# Altium schematic sheet BatteryControl.SchDoc
size A
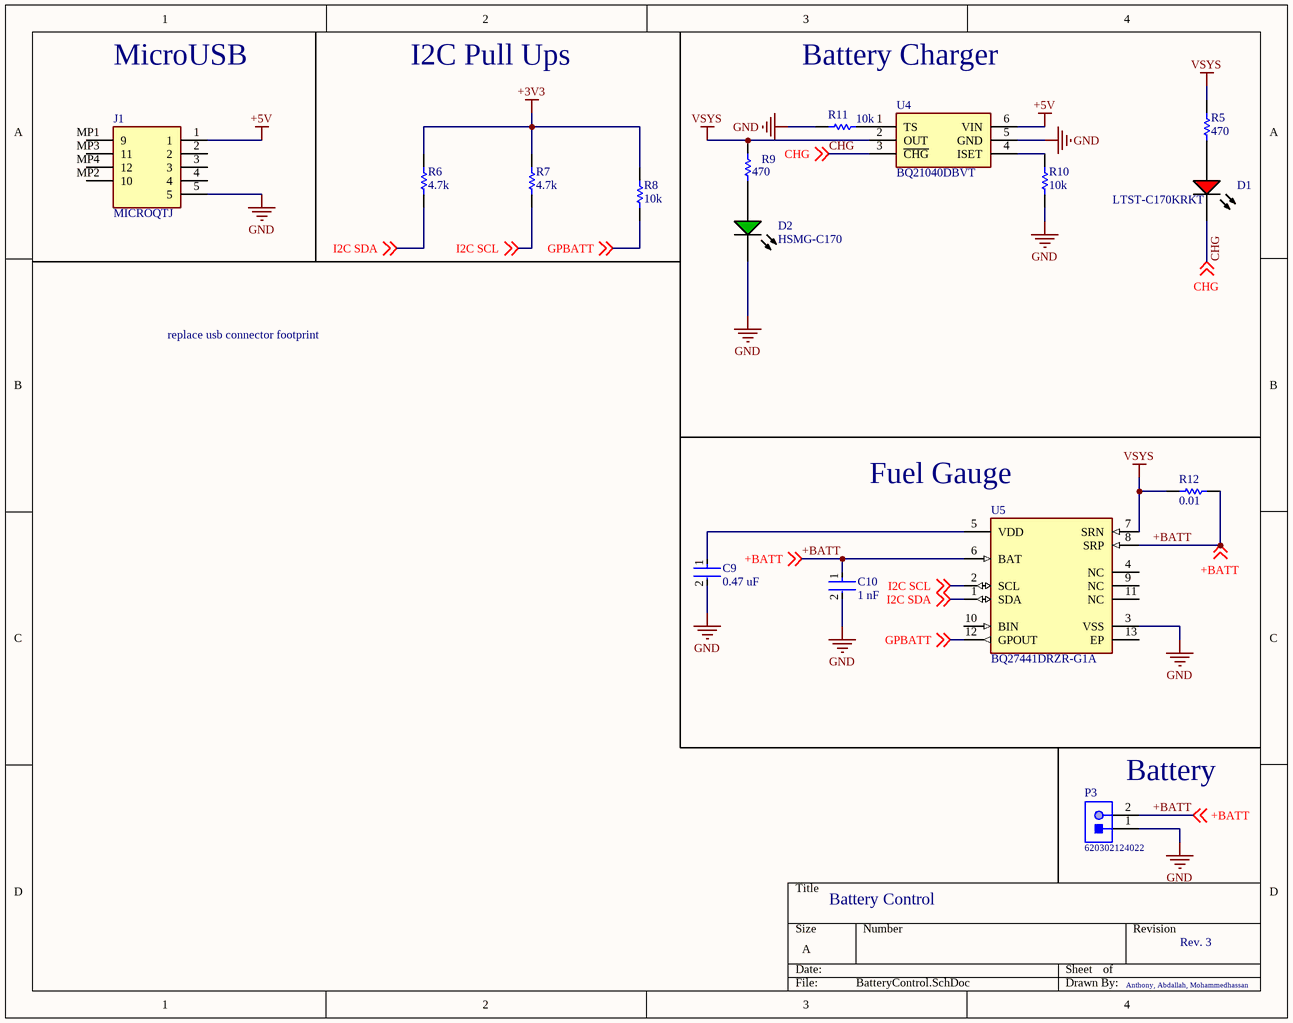
[diagram p0: BatteryControl.SchDoc]

## Parts
C9  0.47 uF  [FP-C0805C-DG-MFG]
C10  1 nF  [FP-C0805C-DG-MFG]
D1  LTST-C170KRKT  [LTST-C170KRKT_V]
D2  HSMG-C170  [AVAG-HSMX-C170_V]
J1  MICROQTJ  [MICROQTJ]
P3  620302124022  [620302124022]
R5  value 470  [RESC2013X70X40ML20T20]  (hidden comment: Resistor 1k +/-1% 0805 125 mW)
R6  value 4.7k  [RESC2013X70X40ML20T20]  (hidden comment: Resistor 1k +/-1% 0805 125 mW)
R7  value 4.7k  [RESC2013X70X40ML20T20]  (hidden comment: Resistor 1k +/-1% 0805 125 mW)
R8  value 10k  [RESC2013X70X40ML20T20]  (hidden comment: Resistor 1k +/-1% 0805 125 mW)
R9  value 470  [RESC2013X70X40ML20T20]  (hidden comment: Resistor 1k +/-1% 0805 125 mW)
R10  value 10k  [RESC2013X70X40ML20T20]  (hidden comment: Resistor 1k +/-1% 0805 125 mW)
R11  value 10k  [RESC2013X70X40ML20T20]  (hidden comment: Resistor 1k +/-1% 0805 125 mW)
R12  value 0.01  [RESC2013X70X40ML20T20]  (hidden comment: Resistor 1k +/-1% 0805 125 mW)
U4  BQ21040DBVT  [SOT95P280X145-6N]
U5  BQ27441DRZR-G1A  [FP-DRZ0012A-MFG]

## Nets
+3V3: R6.2 R7.2 R8.2
+5V: J1.1 U4.6(VIN)
GND: C9.2 C10.2 D2.2(K) J1.5 P3.1 R10.2 R11.2 U4.5(GND) U5.3(VSS)
VSYS: R5.2 R9.2 R12.2 U4.2(OUT) U5.7(SRN)
+BATT: C10.1 P3.2 R12.1 U5.6(BAT) U5.8(SRP) ; off-sheet +BATT
CHG: D1.2(K) U4.3(~{CHG}) ; off-sheet CHG
GPBATT: R8.1 U5.12(GPOUT) ; off-sheet GPBATT
I2C SCL: R7.1 U5.2(SCL) ; off-sheet I2C SCL
I2C SDA: R6.1 U5.1(SDA) ; off-sheet I2C SDA
NetC9_1: C9.1 U5.5(VDD)
NetD1_1: D1.1(A) R5.1
NetD2_1: D2.1(A) R9.1
NetR10_1: R10.1 U4.4(ISET)
NetR11_1: R11.1 U4.1(TS)

Not connected (* = marked no-connect by the designer): J1 2 3 4 MP1(9) MP2(10) MP3(11) MP4(12); U5 4(NC) 9(NC) 10(BIN) 11(NC) 13(EP)

## Notes on the sheet
- MicroUSB
- I2C Pull Ups
- Battery Charger
- replace usb connector footprint
- (near U5) Fuel Gauge
- (near P3) Battery
- Battery Control
- Rev. 3
- Anthony, Abdallah, Mohammedhassan

## Library data of the parts
C9 C10 = CMP-2007-03243-2: CAP CER 10UF 10V X5R 0805; Manufacturer Part Number: C0805C106K8PACTU; Manufacturer: Kemet; 3DS Part Number: 220-00001; Tolerance: 10%; Temperature Coefficient: 15%; Material: Ceramic; Device Class L2: Capacitors; Device Class L1: Passive Components; ComponentLink2URL: https://content.kemet.com/datasheets/KEM_C1006_X5R_SMD.pdf; Height: 1.4mm; Lead Free: Yes; Digikey Description: CAP CER 10UF 10V X5R 0805; Octopart: https://octopart.com/c0805c106k8pactu-kemet-98697; Capacitance: 10uF; Value: 10uF; Temperature Range Low: -55°C; Temperature: -55°C to +85°C; Automotive: No; Mouser Description: CAP CER 10UF 10V X5R 0805; Ipc Land Pattern Name: CAPC200125X125; Temperature Range High: +85°C; Voltage: 10V; RoHS: TRUE; Device Class L3: Ceramic Capacitors; ComponentLink2Description: Datasheet; Voltage Rating: 10V; Package: C0805C-DG; Temperature Characteristic: X5R; Category: Cap
D1 = CMP-2000-07593-1: LED Red, 75 mW, 54 mcd, -55 to 85 degC, 2-Pin SMD, RoHS, Tape and Reel / LCSC Part # C94868; Manufacturer: Lite-On; Lens Transparency: Clear; Number of Elements: 1; Power Rating: 75mW; Luminous Intensity: 54mcd; Viewing Angle: 130degrees; Forward Current: 30mA; Wavelength: 639nm; Lens Style: Rectangular; Case\/Package: 0805; Test Current: 20mA; Dominant Wavelength: 631nm; Forward Voltage: 2V; Lens Colour: Colorless; Min Operating Temperature: -55degC; RoHSCompliant: True; Length: 3.2mm; Width: 1.25mm; Mount: SurfaceMount; Packaging: TapeandReel; Number of LEDs: 1; Radiation Hardening: No; Datasheet URL: http://optoelectronics.liteon.com/upload/download/DS-22-99-0150/LTST-C170KRKT.pdf; Datasheet Version: Rev. D, 11/2014; Case Code (Metric): 2012; Height: 1.1mm; Number of Pins: 2; Package Description: 2-Pin Surface Mount Device, Body 2 x 1.25 mm; Manufacturer URL: http://www.us.liteon.com/; Lead Free: LeadFree; Illumination Colour: Red; Colour: Red; Case Code (Imperial): 0805; Max Operating Temperature: 85degC; Power Dissipation: 75mW; Mounting Technology: SurfaceMount; Package Reference: C170KRKT; Package Quantity: 1; Depth: 1.6mm
D2 = CMP-2000-05062-1: Chip LED, Green, 2.2 V, -40 to 85 degC, 2-Pin SMD, Pb-Free, Tape and Reel / LCSC Part # C188728; Manufacturer: Avago; No. of Pins: 2; Peak Wavelength: 570nm; SVHC: NoSVHC(16-Jun-2014); Dominant Wavelength: 572nm; Forward Current If: 20mA; Viewing Angle: 170deg; Lens Shape: Rectangular; PIV Max: 5V; External Width: 1.25mm; LED Type: Standard; External Depth: 0.8mm; Opto Mounting Orientation: Top; Luminous Intensity: 15mcd; Luminous Intensity Min: 4mcd; Forward Voltage VF Max: 2.6V; External Length / Height: 2mm; Bulb Size: 1.25mmx1.4mm; Light Area Height: 1mm; Voltage Vf Typ: 2.2V; Operating Temperature Max: 85degC; Datasheet Version: Oct-08; MSL: MSL2A-4weeks; Peak Forward Current: 20mA; Package Description: 2-Pin Surface Mount Device, Body 2 x 1.25 mm, Height 0.8 mm; Datasheet URL: https://datasheet.ciiva.com/29280/180495-da-01-en-chip-led-hsmg-c170-gelb-gruen-29280971.pdf; Storage Temperature Min: -40degC; LED Colour: Green; Wavelength Typ: 570nm; Mounting Type: SMD; Forward Current If Max: 20mA; Dominant Wavelength Typ: 572nm; LED Mounting: SMD; Operating Temperature Range: -30degCto+85degC; Operating Temperature Min: -30degC; Manufacturer URL: http://www.avagotech.com/; Packaging: CutTape; Luminous Intensity Typ: 15mcd; Package Reference: HSMX-C170; Storage Temperature Max: 85degC; Opto Case Style: SMD; Forward Voltage: 2.2V
J1 = MICROQTJ: Connector / LCSC Part # C404968; Manufacturer_Name: Shou Han; Datasheet Link: https://datasheet.lcsc.com/szlcsc/1908151409_SHOU-HAN-MicroQTJ_C404968.pdf; Height: 1.93mm; Manufacturer_Part_Number: MICROQTJ
P3 = CMP-1502-00660-1: Male Shrouded Header WR-WTB, SMT, Vertical, pitch 2 mm, 1 x 2 position / WON'T BE POPULATED BY MANUFACTURER; Manufacturer: Wurth Elektronik; Pitch: 2mm; Position: 1x2; Working Voltage: 100VAC; Contact Resistance: 20mOhm; Package Reference: 620302124022; Manufacturer URL: http://www.we-online.de; Gender: Male; Orientation: Vertical; Publisher: WurthElektronik; Mounting Technology: SMT; Operating Temperature: -25to85degC; Datasheet URL: https://katalog.we-online.de/em/datasheet/6203xx124022.pdf; Packaging: TapeandReel; Part Number: 620302124022
R5-R12 = CMP-009-00010-4: Chip Resistor, 1 KOhm, +/- 1%, 0.125 W, -55 to 155 degC, 0805 (2013 Metric); Power: 125mW; Voltage Rating: 150V; Min Operating Temperature: -55°C; RoHS Compliant: True; Max Operating Temperature: 155°C; Case/Package: 0805; Pins: 2; Tolerance: 1%; Mounting Technology: SM
U4 = BQ21040DBVT: Integrated Circuit / LCSC Part # C78978; Manufacturer_Name: Texas Instruments; Datasheet Link: http://www.ti.com/lit/gpn/bq21040; Height: 1.45mm; Manufacturer_Part_Number: BQ21040DBVT; Mouser Part Number: 595-BQ21040DBVT; Mouser Price/Stock: https://www.mouser.co.uk/ProductDetail/Texas-Instruments/BQ21040DBVT/?qs=cttFivMKqWxXmJjs8S2Pcw%3D%3D; Arrow Part Number: BQ21040DBVT; Arrow Price/Stock: https://www.arrow.com/en/products/bq21040dbvt/texas-instruments
U5 = CMP-04911-000008-1: IC BATT FUEL GAUGE LI-ION 12SON / WON'T BE POPULATED BY MANUFACTURER; Manufacturer: Texas Instruments; Number Of Cells: 1; Nominal Supply Current: 93uA; Max Supply Voltage: 4.5V; Standoff Height: 0mm; Min Supply Voltage: 2.45V; Output Voltage: 1.8V; Temperature Range High: +85°C; Temperature: -40°C to +85°C; Device Class L2: Power Management ICs; Device Class L1: Integrated Circuits (ICs); Lead Free: Yes; Height: 1mm; Package: DRZ0012A; Number Of Outputs: 1; ComponentLink2URL: http://www.ti.com/lit/gpn/bq27441-g1; Ambient Temperature Range High: +85°C; Category: IC; Manufacturer Part Number: BQ27441DRZR-G1A; Device Class L3: Battery Management; RoHS: TRUE; Octopart: https://octopart.com/bq27441drzr-g1a-texas+instruments-30555829; Ambient Temperature Range Low: -40°C; Automotive: No; Mouser Description: System-Side Impedance Track? Battery Fuel (Gas) Gauge 12-SON -40 to 85; Digikey Description: IC BATT FUEL GAUGE LI-ION 12SON; Temperature Range Low: -40°C; ComponentLink2Description: Datasheet